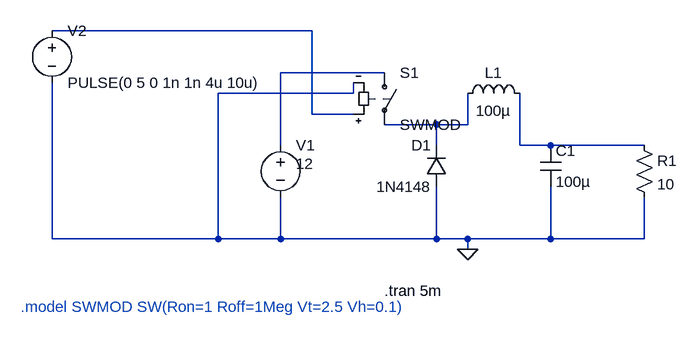
[diagram p0: schematic non-ideal buck converter simulation.asc]
non-ideal buck converter simulation.asc, the LTspice schematic file:
Version 4.1
SHEET 1 880 680
WIRE -32 -112 -432 -112
WIRE 80 -48 -80 -48
WIRE 32 -16 32 -32
WIRE 32 -16 -176 -16
WIRE -32 16 -32 -112
WIRE 32 16 -32 16
WIRE 160 32 80 32
WIRE 208 32 208 -16
WIRE 208 32 160 32
WIRE -80 64 -80 -48
WIRE 160 64 160 32
WIRE 288 64 288 -16
WIRE 336 64 288 64
WIRE 480 64 336 64
WIRE -432 208 -432 -32
WIRE -176 208 -176 -16
WIRE -176 208 -432 208
WIRE -80 208 -80 144
WIRE -80 208 -176 208
WIRE 160 208 160 128
WIRE 160 208 -80 208
WIRE 208 208 160 208
WIRE 336 208 336 128
WIRE 336 208 208 208
WIRE 480 208 480 144
WIRE 480 208 336 208
WIRE 208 224 208 208
FLAG 208 224 0
SYMBOL diode 176 128 R180
WINDOW 0 24 64 Left 2
WINDOW 3 24 0 Left 2
SYMATTR InstName D1
SYMATTR Value 1N4148
SYMBOL voltage -80 48 R0
WINDOW 3 24 44 Left 2
WINDOW 123 0 0 Left 0
WINDOW 39 0 0 Left 0
SYMATTR Value 12
SYMATTR InstName V1
SYMBOL cap 320 64 R0
SYMATTR InstName C1
SYMATTR Value 100µ
SYMBOL ind 192 0 R270
WINDOW 0 32 56 VTop 2
WINDOW 3 5 56 VBottom 2
SYMATTR InstName L1
SYMATTR Value 100µ
SYMATTR SpiceLine Rser=1m
SYMBOL res 464 48 R0
SYMATTR InstName R1
SYMATTR Value 10
SYMBOL sw 80 -64 R0
SYMATTR InstName S1
SYMATTR Value SWMOD
SYMBOL voltage -432 -128 R0
WINDOW 123 0 0 Left 0
WINDOW 39 0 0 Left 0
SYMATTR InstName V2
SYMATTR Value PULSE(0 5 0 1n 1n 4u 10u)
TEXT 80 288 Left 2 !.tran 5m
TEXT -480 312 Left 2 ;.model SWMOD SW(Ron=1 Roff=1Meg Vt=2.5 Vh=0.1)

The netlist it stands for:
* non-ideal buck converter simulation.asc
D1 0 N003 1N4148
V1 N002 0 12
C1 N004 0 100µ
L1 N003 N004 100µ Rser=1m
R1 N004 0 10
S1 N002 N003 N001 0 SWMOD
V2 N001 0 PULSE(0 5 0 1n 1n 4u 10u)
.model D D
.lib standard.dio
.tran 5m
* .model SWMOD SW(Ron=1 Roff=1Meg Vt=2.5 Vh=0.1)
.backanno
.end